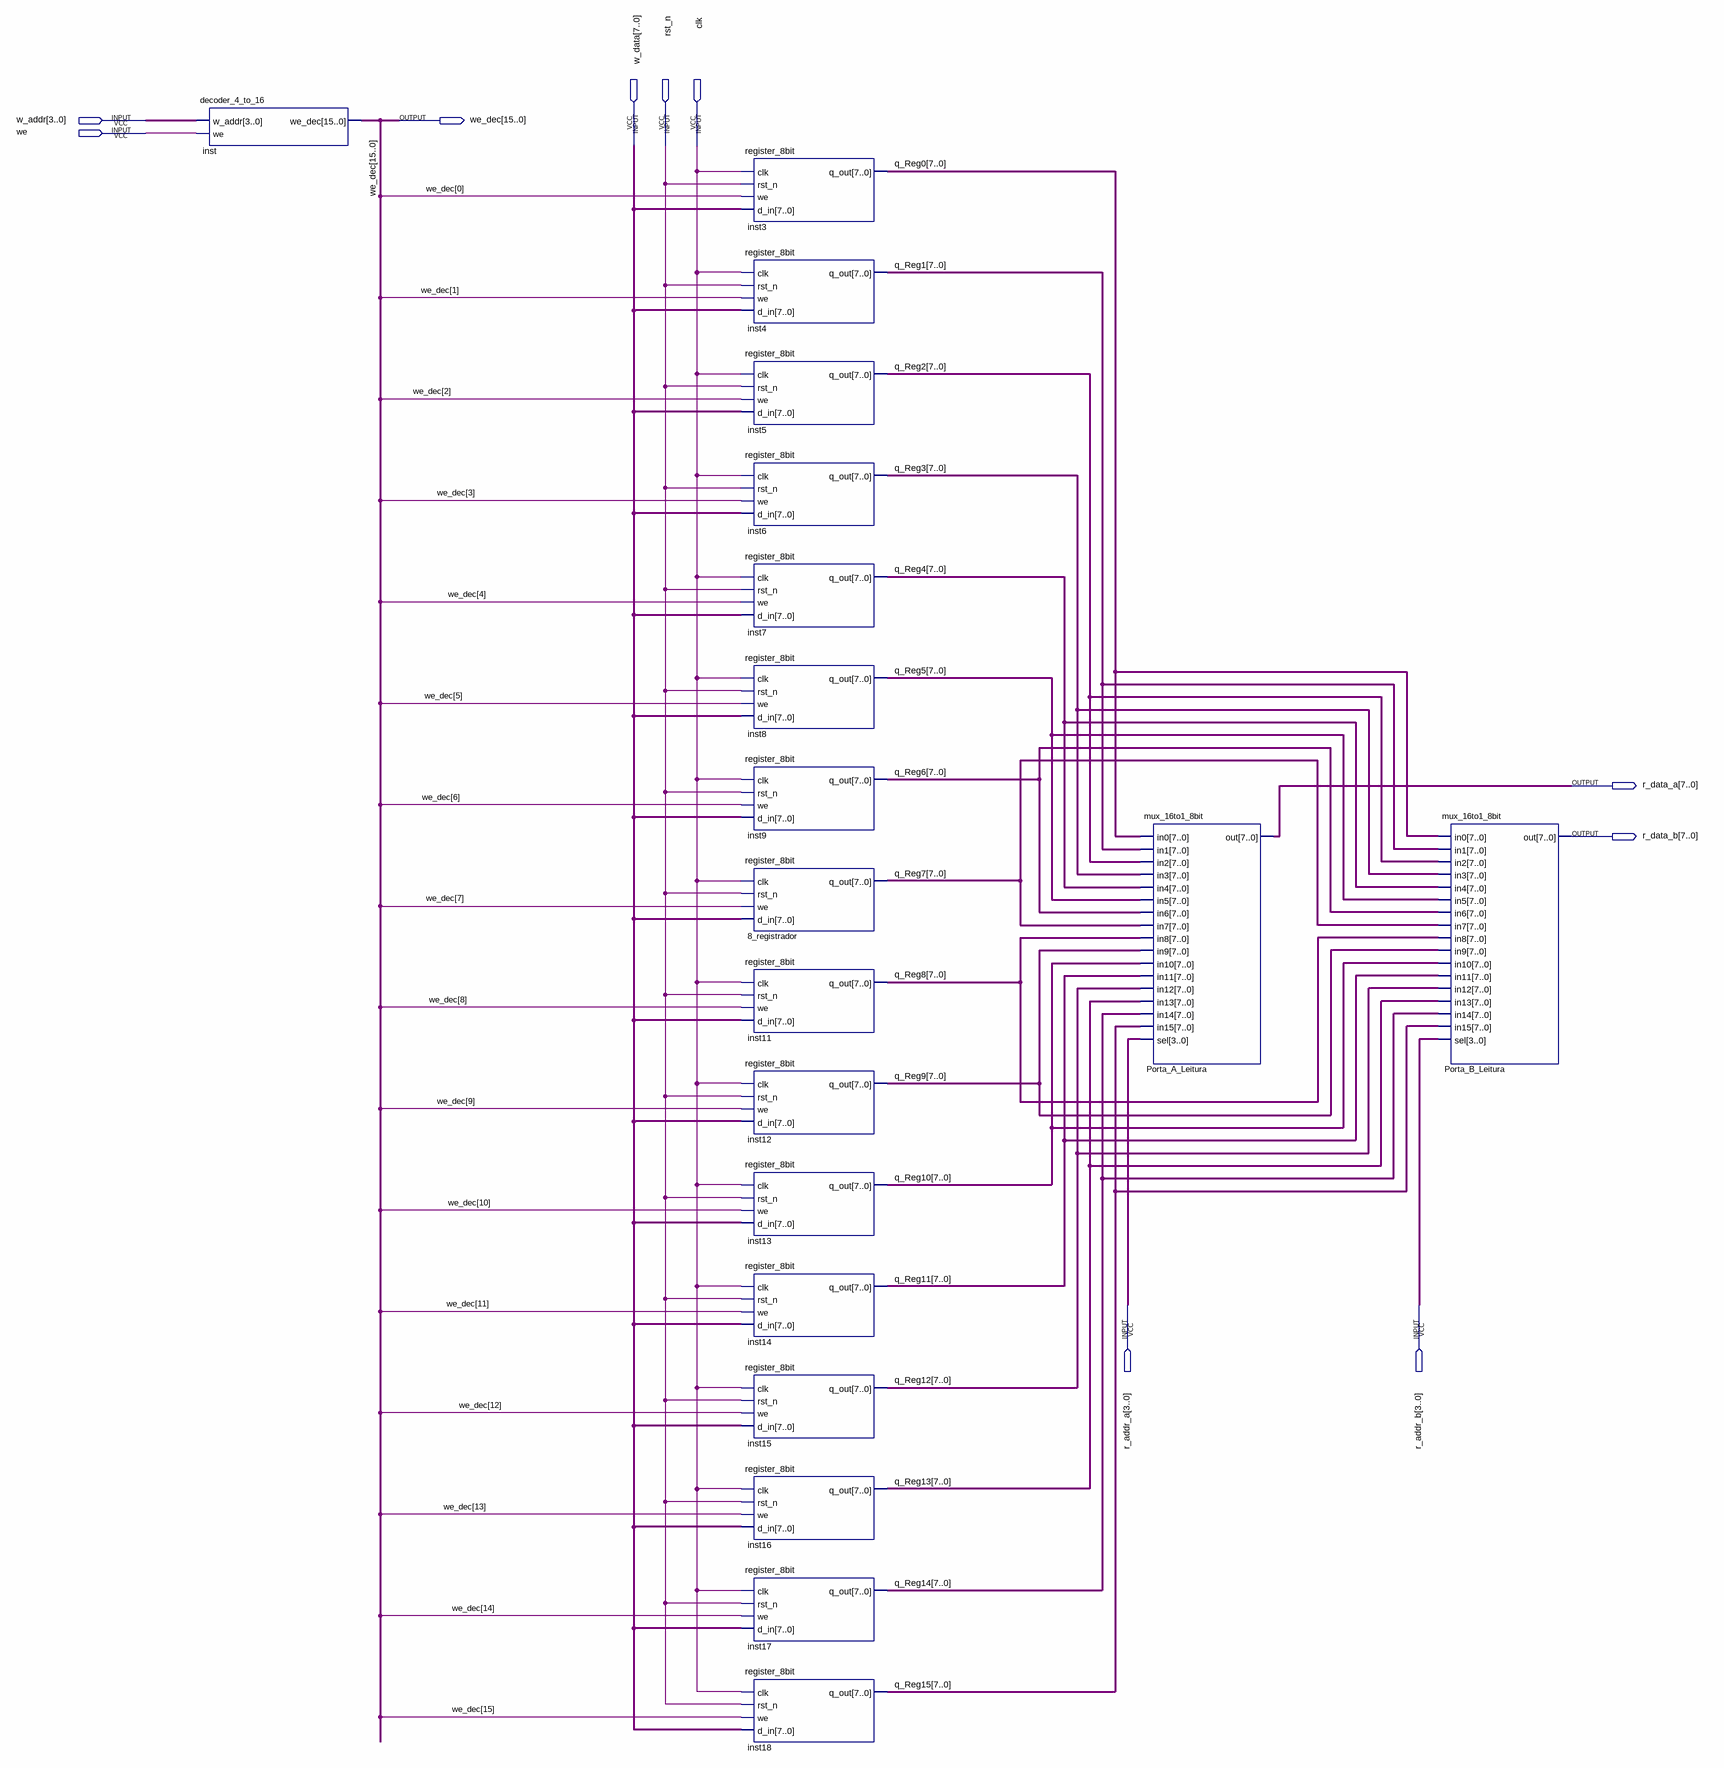
[diagram p0: schematic sheet]
// Quartus schematic banco_de_registadores_top.bdf as structural Verilog: 19 symbols, 10 pins
module banco_de_registadores_top (
  input  [3:0] w_addr,
  input  we,
  input  [7:0] w_data,
  input  rst_n,
  input  clk,
  input  [3:0] r_addr_a,
  input  [3:0] r_addr_b,
  output [15:0] we_dec,
  output [7:0] r_data_a,
  output [7:0] r_data_b
);

  wire [7:0] q_Reg0, q_Reg1, q_Reg2, q_Reg3, q_Reg4, q_Reg5, q_Reg6, q_Reg7, q_Reg8, q_Reg9, q_Reg10,
       q_Reg11, q_Reg12, q_Reg13, q_Reg14, q_Reg15;

  decoder_4_to_16 inst (.w_addr(w_addr), .we(we), .we_dec(we_dec));
  register_8bit inst3 (.clk(clk), .rst_n(rst_n), .we(we_dec[0]), .d_in(w_data), .q_out(q_Reg0));
  register_8bit inst4 (.clk(clk), .rst_n(rst_n), .we(we_dec[1]), .d_in(w_data), .q_out(q_Reg1));
  register_8bit inst5 (.clk(clk), .rst_n(rst_n), .we(we_dec[2]), .d_in(w_data), .q_out(q_Reg2));
  register_8bit inst6 (.clk(clk), .rst_n(rst_n), .we(we_dec[3]), .d_in(w_data), .q_out(q_Reg3));
  register_8bit inst7 (.clk(clk), .rst_n(rst_n), .we(we_dec[4]), .d_in(w_data), .q_out(q_Reg4));
  register_8bit inst8 (.clk(clk), .rst_n(rst_n), .we(we_dec[5]), .d_in(w_data), .q_out(q_Reg5));
  register_8bit inst9 (.clk(clk), .rst_n(rst_n), .we(we_dec[6]), .d_in(w_data), .q_out(q_Reg6));
  register_8bit u_8_registrador (.clk(clk), .rst_n(rst_n), .we(we_dec[7]), .d_in(w_data), .q_out(q_Reg7));
  register_8bit inst11 (.clk(clk), .rst_n(rst_n), .we(we_dec[8]), .d_in(w_data), .q_out(q_Reg8));
  register_8bit inst12 (.clk(clk), .rst_n(rst_n), .we(we_dec[9]), .d_in(w_data), .q_out(q_Reg9));
  register_8bit inst13 (.clk(clk), .rst_n(rst_n), .we(we_dec[10]), .d_in(w_data), .q_out(q_Reg10));
  register_8bit inst14 (.clk(clk), .rst_n(rst_n), .we(we_dec[11]), .d_in(w_data), .q_out(q_Reg11));
  register_8bit inst15 (.clk(clk), .rst_n(rst_n), .we(we_dec[12]), .d_in(w_data), .q_out(q_Reg12));
  register_8bit inst16 (.clk(clk), .rst_n(rst_n), .we(we_dec[13]), .d_in(w_data), .q_out(q_Reg13));
  register_8bit inst17 (.clk(clk), .rst_n(rst_n), .we(we_dec[14]), .d_in(w_data), .q_out(q_Reg14));
  register_8bit inst18 (.clk(clk), .rst_n(rst_n), .we(we_dec[15]), .d_in(w_data), .q_out(q_Reg15));
  mux_16to1_8bit Porta_A_Leitura (
    .in0(q_Reg0), .in1(q_Reg1), .in2(q_Reg2), .in3(q_Reg3), .in4(q_Reg4), .in5(q_Reg5), .in6(q_Reg6),
    .in7(q_Reg7), .in8(q_Reg8), .in9(q_Reg9), .in10(q_Reg10), .in11(q_Reg11), .in12(q_Reg12), .in13(q_Reg13),
    .in14(q_Reg14), .in15(q_Reg15), .sel(r_addr_a), .out(r_data_a));
  mux_16to1_8bit Porta_B_Leitura (
    .in0(q_Reg0), .in1(q_Reg1), .in2(q_Reg2), .in3(q_Reg3), .in4(q_Reg4), .in5(q_Reg5), .in6(q_Reg6),
    .in7(q_Reg7), .in8(q_Reg8), .in9(q_Reg9), .in10(q_Reg10), .in11(q_Reg11), .in12(q_Reg12), .in13(q_Reg13),
    .in14(q_Reg14), .in15(q_Reg15), .sel(r_addr_b), .out(r_data_b));
endmodule
